# Altium schematic sheet BOC_DAUGHTER.SchDoc: Board-On-Chip Daughter Connectors
size B; Organization: Altium Limited; Address1: L3, 12a Rodborough Rd; Address2: Frenchs Forest; Address3: NSW; Address4: Australia 2086; Revision: 1.06; SheetNumber: 8; SheetTotal: 16
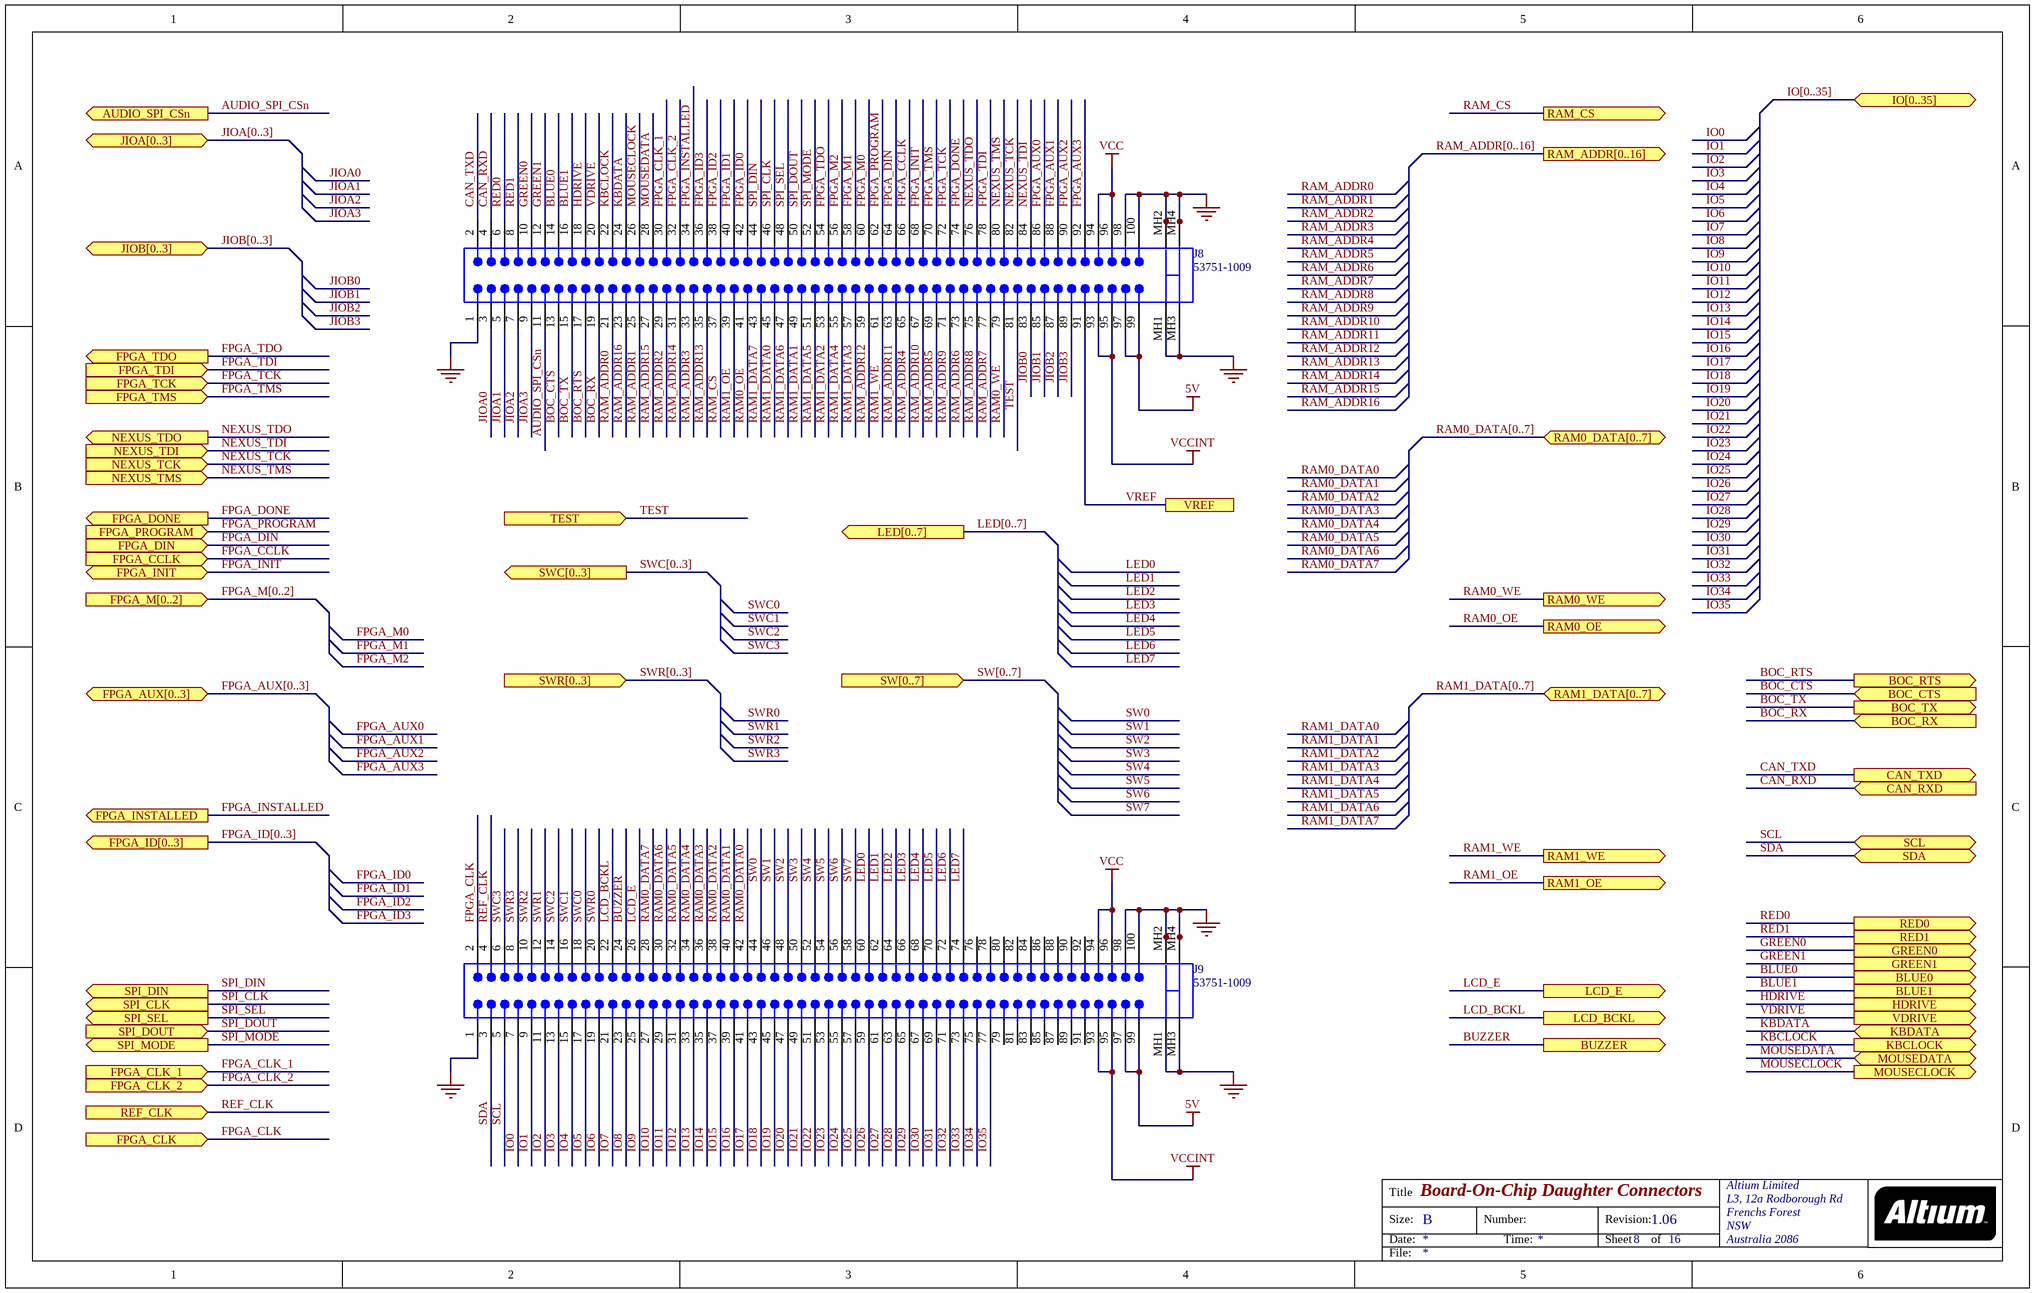
[diagram p0: BOC_DAUGHTER.SchDoc]

## Parts
J8  53751-1009  [53751]
J9  53751-1009  [53751]

## Ports
AUDIO_SPI_CSn (out), BLUE0 (out), BLUE1 (out), BOC_CTS (in), BOC_RTS (out), BOC_RX (in), BOC_TX (out), BUZZER (out), CAN_RXD (in), CAN_TXD (out), FPGA_AUX[0..3] (bidir), FPGA_CCLK (in), FPGA_CLK (in), FPGA_CLK_1 (in), FPGA_CLK_2 (in), FPGA_DIN (in), FPGA_DONE (out), FPGA_ID[0..3] (out), FPGA_INIT (bidir), FPGA_INSTALLED (out), FPGA_M[0..2] (in), FPGA_PROGRAM (in), FPGA_TCK (in), FPGA_TDI (in), FPGA_TDO (out), FPGA_TMS (in), GREEN0 (out), GREEN1 (out), HDRIVE (out), IO[0..35] (bidir), JIOA[0..3] (bidir), JIOB[0..3] (bidir), KBCLOCK (out), KBDATA (bidir), LCD_BCKL (out), LCD_E (out), LED[0..7] (out), MOUSECLOCK (out), MOUSEDATA (bidir), NEXUS_TCK (in), NEXUS_TDI (in), NEXUS_TDO (out), NEXUS_TMS (in), RAM0_DATA[0..7] (bidir), RAM0_OE (out), RAM0_WE (out), RAM1_DATA[0..7] (bidir), RAM1_OE (out), RAM1_WE (out), RAM_ADDR[0..16] (out), RAM_CS (out), RED0 (out), RED1 (out), REF_CLK (in), SCL (bidir), SDA (bidir), SPI_CLK (out), SPI_DIN (out), SPI_DOUT (in), SPI_MODE (out), SPI_SEL (out), SW[0..7] (in), SWC[0..3] (out), SWR[0..3] (in), TEST (in), VDRIVE (out), VREF

## Nets
5V: J8.97 J8.99 J9.97 J9.99
GND: J8.1 J8.98 J8.100 J8.MH1 J8.MH2 J8.MH2A J8.MH2B J8.MH3 J8.MH4 J8.MH4A J8.MH4B J9.1 J9.98 J9.100 J9.MH1 J9.MH2 J9.MH2A J9.MH2B J9.MH3 J9.MH4 J9.MH4A J9.MH4B
VCC: J8.94 J8.96 J9.94 J9.96
VCCINT: J8.93 J8.95 J9.93 J9.95
AUDIO_SPI_CSn: J8.11 ; port AUDIO_SPI_CSn
BLUE0: J8.14 ; port BLUE0
BLUE1: J8.16 ; port BLUE1
BOC_CTS: J8.13 ; port BOC_CTS
BOC_RTS: J8.17 ; port BOC_RTS
BOC_RX: J8.19 ; port BOC_RX
BOC_TX: J8.15 ; port BOC_TX
BUZZER: J9.24 ; port BUZZER
CAN_RXD: J8.4 ; port CAN_RXD
CAN_TXD: J8.2 ; port CAN_TXD
FPGA_AUX0: J8.86
FPGA_AUX1: J8.88
FPGA_AUX2: J8.90
FPGA_AUX3: J8.92
FPGA_CCLK: J8.66 ; port FPGA_CCLK
FPGA_CLK: J9.2 ; port FPGA_CLK
FPGA_CLK_1: J8.30 ; port FPGA_CLK_1
FPGA_CLK_2: J8.32 ; port FPGA_CLK_2
FPGA_DIN: J8.64 ; port FPGA_DIN
FPGA_DONE: J8.74 ; port FPGA_DONE
FPGA_ID0: J8.42
FPGA_ID1: J8.40
FPGA_ID2: J8.38
FPGA_ID3: J8.36
FPGA_INIT: J8.68 ; port FPGA_INIT
FPGA_INSTALLED: J8.34 ; port FPGA_INSTALLED
FPGA_M0: J8.60
FPGA_M1: J8.58
FPGA_M2: J8.56
FPGA_PROGRAM: J8.62 ; port FPGA_PROGRAM
FPGA_TCK: J8.72 ; port FPGA_TCK
FPGA_TDI: J8.78 ; port FPGA_TDI
FPGA_TDO: J8.54 ; port FPGA_TDO
FPGA_TMS: J8.70 ; port FPGA_TMS
GREEN0: J8.10 ; port GREEN0
GREEN1: J8.12 ; port GREEN1
HDRIVE: J8.18 ; port HDRIVE
IO0: J9.7
IO1: J9.9
IO2: J9.11
IO3: J9.13
IO4: J9.15
IO5: J9.17
IO6: J9.19
IO7: J9.21
IO8: J9.23
IO9: J9.25
IO10: J9.27
IO11: J9.29
IO12: J9.31
IO13: J9.33
IO14: J9.35
IO15: J9.37
IO16: J9.39
IO17: J9.41
IO18: J9.43
IO19: J9.45
IO20: J9.47
IO21: J9.49
IO22: J9.51
IO23: J9.53
IO24: J9.55
IO25: J9.57
IO26: J9.59
IO27: J9.61
IO28: J9.63
IO29: J9.65
IO30: J9.67
IO31: J9.69
IO32: J9.71
IO33: J9.73
IO34: J9.75
IO35: J9.77
JIOA0: J8.3
JIOA1: J8.5
JIOA2: J8.7
JIOA3: J8.9
JIOB0: J8.83
JIOB1: J8.85
JIOB2: J8.87
JIOB3: J8.89
KBCLOCK: J8.22 ; port KBCLOCK
KBDATA: J8.24 ; port KBDATA
LCD_BCKL: J9.22 ; port LCD_BCKL
LCD_E: J9.26 ; port LCD_E
LED0: J9.60
LED1: J9.62
LED2: J9.64
LED3: J9.66
LED4: J9.68
LED5: J9.70
LED6: J9.72
LED7: J9.74
MOUSECLOCK: J8.26 ; port MOUSECLOCK
MOUSEDATA: J8.28 ; port MOUSEDATA
NEXUS_TCK: J8.82 ; port NEXUS_TCK
NEXUS_TDI: J8.84 ; port NEXUS_TDI
NEXUS_TDO: J8.76 ; port NEXUS_TDO
NEXUS_TMS: J8.80 ; port NEXUS_TMS
RAM0_DATA0: J9.42
RAM0_DATA1: J9.40
RAM0_DATA2: J9.38
RAM0_DATA3: J9.36
RAM0_DATA4: J9.34
RAM0_DATA5: J9.32
RAM0_DATA6: J9.30
RAM0_DATA7: J9.28
RAM0_OE: J8.41 ; port RAM0_OE
RAM0_WE: J8.79 ; port RAM0_WE
RAM1_DATA0: J8.45
RAM1_DATA1: J8.49
RAM1_DATA2: J8.53
RAM1_DATA3: J8.57
RAM1_DATA4: J8.55
RAM1_DATA5: J8.51
RAM1_DATA6: J8.47
RAM1_DATA7: J8.43
RAM1_OE: J8.39 ; port RAM1_OE
RAM1_WE: J8.61 ; port RAM1_WE
RAM_ADDR0: J8.21
RAM_ADDR1: J8.25
RAM_ADDR2: J8.29
RAM_ADDR3: J8.33
RAM_ADDR4: J8.65
RAM_ADDR5: J8.69
RAM_ADDR6: J8.73
RAM_ADDR7: J8.77
RAM_ADDR8: J8.75
RAM_ADDR9: J8.71
RAM_ADDR10: J8.67
RAM_ADDR11: J8.63
RAM_ADDR12: J8.59
RAM_ADDR13: J8.35
RAM_ADDR14: J8.31
RAM_ADDR15: J8.27
RAM_ADDR16: J8.23
RAM_CS: J8.37 ; port RAM_CS
RED0: J8.6 ; port RED0
RED1: J8.8 ; port RED1
REF_CLK: J9.4 ; port REF_CLK
SCL: J9.5 ; port SCL
SDA: J9.3 ; port SDA
SPI_CLK: J8.46 ; port SPI_CLK
SPI_DIN: J8.44 ; port SPI_DIN
SPI_DOUT: J8.50 ; port SPI_DOUT
SPI_MODE: J8.52 ; port SPI_MODE
SPI_SEL: J8.48 ; port SPI_SEL
SW0: J9.44
SW1: J9.46
SW2: J9.48
SW3: J9.50
SW4: J9.52
SW5: J9.54
SW6: J9.56
SW7: J9.58
SWC0: J9.18
SWC1: J9.16
SWC2: J9.14
SWC3: J9.6
SWR0: J9.20
SWR1: J9.12
SWR2: J9.10
SWR3: J9.8
TEST: J8.81 ; port TEST
VDRIVE: J8.20 ; port VDRIVE
VREF: J8.91 ; port VREF

Not connected (* = marked no-connect by the designer): J9 76 78 79 80 81 82 83 84 85 86 87 88 89 90 91 92

## Buses and harness runs
bus FPGA_AUX[0..3] = port FPGA_AUX[0..3]
bus FPGA_ID[0..3] = port FPGA_ID[0..3]
bus FPGA_M[0..2] = port FPGA_M[0..2]
bus IO[0..35] = port IO[0..35]
bus JIOA[0..3] = port JIOA[0..3]
bus JIOB[0..3] = port JIOB[0..3]
bus LED[0..7] = port LED[0..7]
bus RAM0_DATA[0..7] = port RAM0_DATA[0..7]
bus RAM1_DATA[0..7] = port RAM1_DATA[0..7]
bus RAM_ADDR[0..16] = port RAM_ADDR[0..16]
bus SW[0..7] = port SW[0..7]
bus SWC[0..3] = port SWC[0..3]
bus SWR[0..3] = port SWR[0..3]

## Notes on the sheet
- Title
- Size:
- Date:
- B
- Number:
- Time:
- Revision:
- Sheet
- of
- File:

## Library data of the parts
J8 J9 = 53751-1009: Board-to-Board, Docking Station, 0.80mm (.031") Pitch, Shielded Plug, Vertical, Ultra Low Profile, SMT; Manufacturer: Molex; Package Information: Latest Revision: Jun-2001; Mating Height: 8.5mm; Voltage: 100V; Current: 0.5A; Contact Resistance: 40mOhm max; PCB Layout: Complies with Manufacturer's Recommendation.; Fitted: True; Published: 15-Oct-2003; Datasheet: Latest Revision: Feb-2002; Package Reference: 53751; Publisher: Altium Limited